# Altium project PCB_Testing_Projekt.PrjPcb
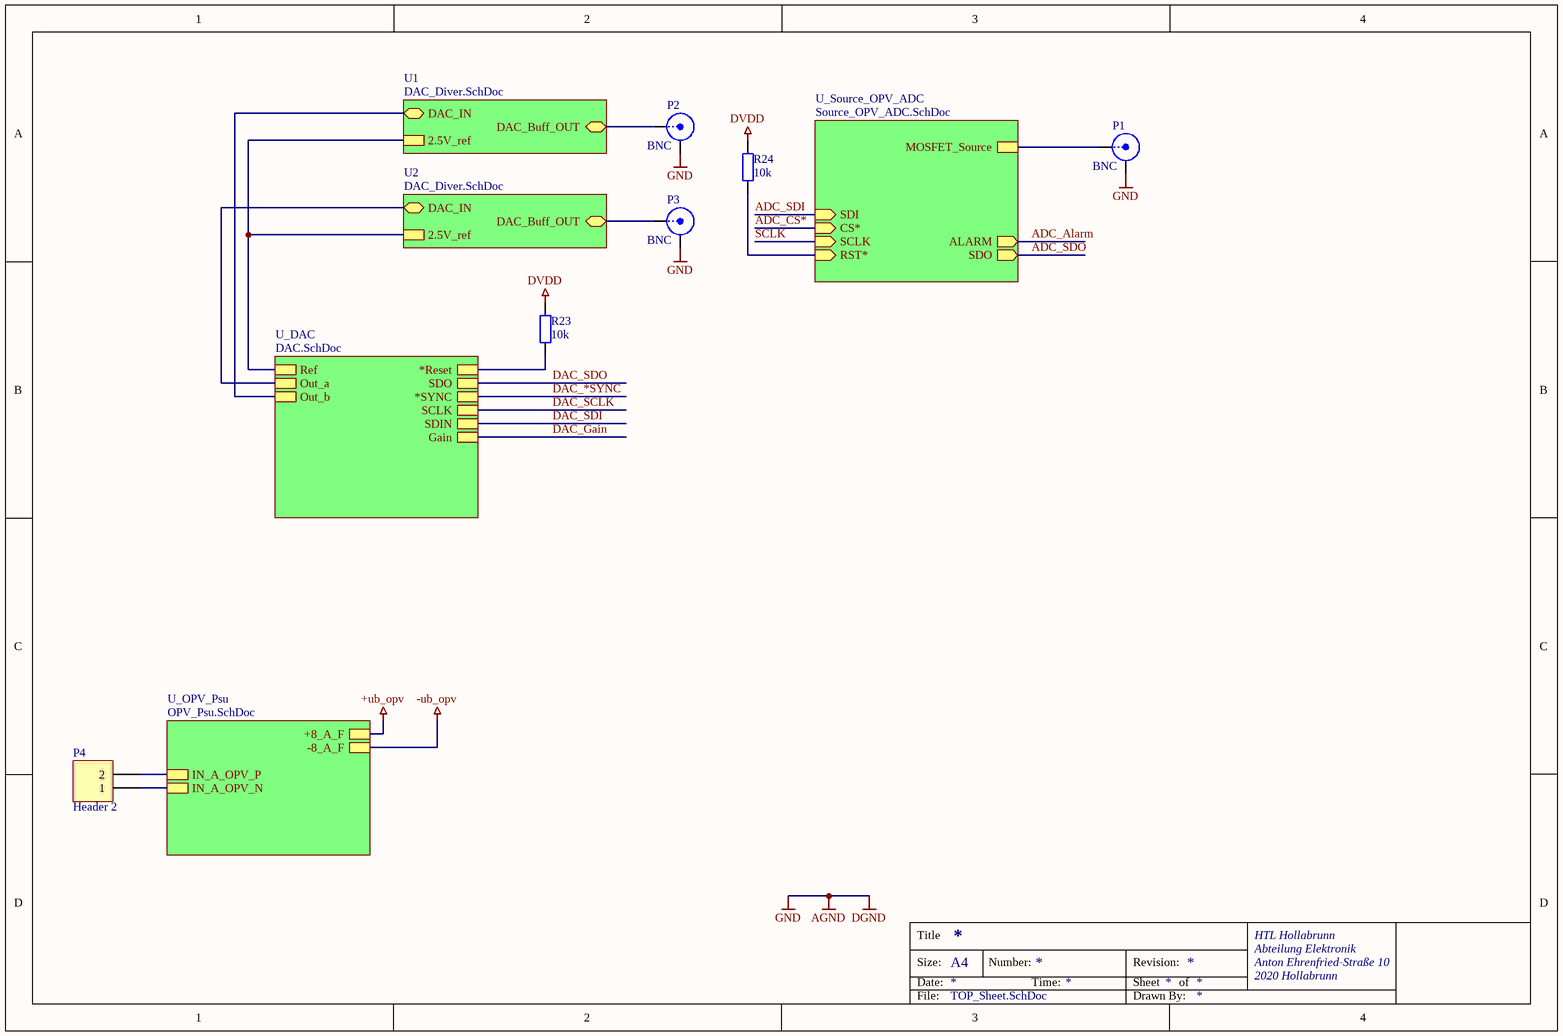
[diagram p0: TOP_Sheet.SchDoc]
5 sheets, 58 parts. Net scope: hierarchical (ports join the sheet entries above them; power ports are global).
Board file: PCB1.PcbDoc
Sheets:
  TOP_Sheet.SchDoc
    U_Source_OPV_ADC = Source_OPV_ADC.SchDoc
    U_OPV_Psu = OPV_Psu.SchDoc
    U2 = DAC_Diver.SchDoc
    U1 = DAC_Diver.SchDoc
    U_DAC = DAC.SchDoc

## Sheet TOP_Sheet.SchDoc
size A4; Organization: HTL Hollabrunn; Address1: Abteilung Elektronik; Address2: Anton Ehrenfried-Straße 10; Address3: 2020 Hollabrunn; SPICEModelCacheBIRIWKQP: <root> / <DocumentId>BIRIWKQP</DocumentId> / </root>

### Parts
P1  BNC  [BNC_RA CON]
P2  BNC  [BNC_RA CON]
P3  BNC  [BNC_RA CON]
P4  Header 2  [HDR1X2]
R23  10k  [C1206-KUE]
R24  10k  [C1206-KUE]

### Sub-sheets
U1 = DAC_Diver.SchDoc: DAC_IN (bidir), DAC_Buff_OUT (bidir), 2.5V_ref
U2 = DAC_Diver.SchDoc: DAC_IN (bidir), DAC_Buff_OUT (bidir), 2.5V_ref
U_DAC = DAC.SchDoc: Ref, Out_a, Out_b, SDIN, SDO, SCLK, *SYNC, Gain, *Reset
U_OPV_Psu = OPV_Psu.SchDoc: IN_A_OPV_P, +8_A_F, IN_A_OPV_N, -8_A_F
U_Source_OPV_ADC = Source_OPV_ADC.SchDoc: MOSFET_Source, SDI (in), CS* (in), SCLK (in), SDO (out), ALARM (out), RST* (in)

### Nets
AGND: P1.2(Y) P2.2(Y) P3.2(Y)  [also labelled DGND, GND]
DVDD: R23.1 R24.1
NetC6_1: P1.1(X) ; sheet U_Source_OPV_ADC/MOSFET_Source
NetC14_2: sheet U2/2.5V_ref, sheet U1/2.5V_ref, sheet U_DAC/Ref
NetP2_1: P2.1(X) ; sheet U1/DAC_Buff_OUT
NetP3_1: P3.1(X) ; sheet U2/DAC_Buff_OUT
NetP4_1: P4.1 ; sheet U_OPV_Psu/IN_A_OPV_N
NetP4_2: P4.2 ; sheet U_OPV_Psu/IN_A_OPV_P
NetR2_1: R24.2 ; sheet U_Source_OPV_ADC/RST*
NetR7_U1_2: sheet U1/DAC_IN, sheet U_DAC/Out_b
NetR7_U2_2: sheet U2/DAC_IN, sheet U_DAC/Out_a
NetR23_2: R23.2 ; sheet U_DAC/*Reset

### Notes on the sheet
- Title
- Size:
- Date:
- A4
- Number:
- Time:
- Revision:
- Sheet
- of
- HTL Hollabrunn
- Abteilung Elektronik
- Anton Ehrenfried-Straße 10
- 2020 Hollabrunn
- File:
- Drawn By:

### Library data of the parts
P1-P3 = BNC: BNC Elbow Connector; LatestRevisionDate: 17-Jul-2002; LatestRevisionNote: Re-released for DXP Platform.; Publisher: Altium Limited
P4 = Header 2: Header, 2-Pin; LatestRevisionDate: 17-Jul-2002; LatestRevisionNote: Re-released for DXP Platform.; Publisher: Altium Limited
R23 R24 = ResistorSMD: Resistor SMD; Manufacturer: AVX; Bezeichnung: SMD Wid. 1/8W 2%; Published: 8-Jun-2000; LatestRevisionDate: 17-Jul-2002; LatestRevisionNote: Re-released for DXP Platform.; PackageReference: AXIAL-0.4; Publisher: Altium Limited; PackageDescription: Axial Device, Thru-Hole; 2 Leads; 0.4 in Pin Spacing; Value: 10k; Orderingcode: *

## Sheet Source_OPV_ADC.SchDoc
size A4; Organization: HTL Hollabrunn; Address1: Abteilung Elektronik; Address2: Anton Ehrenfried-Straße 10; Address3: 2020 Hollabrunn; SheetNumber: 1; SheetTotal: 1; SPICEModelCacheDVQSEWCR: <root> / <DocumentId>DVQSEWCR</DocumentId> / <CacheFrame Number="0"> / <Model Name="ua741" Kind="CKT"> / <Text>*==================================================== / *uA741 / *Sngl GenPurpose OpAmp pkg:DIP8 3,2,7,4,6. pkg:CAN8 3,2,7,4,6. / * Connections: / *             Non-Inverting Input / *             | Inverting Input / *             | | Positive Power Supply / *             | | | Negative Power Supply / *             | | | | Output / *             | | | | | / .SUBCKT UA741 1 2 3 4 5 / C1   11 12 4.664E-12 / C2    6  7 20E-12 / DC    5 53 DX / DE   54  5 DX / DLP  90 91 DX / DLN  92 90 DX / DP    4  3 DX / BGND 99  0 V=V(3)*.5 + V(4)*.5 / BB    7 99 I=I(VB)*10.61E6 - I(VC)*10E6 + I(VE)*10E6 + / +              I(VLP)*10E6 - I(VLN)*10E6 / GA    6  0 11 12 137.7E-6 / GCM   0  6 10 99 2.574E-9 / IEE  10  4 DC 10.16E-6 / HLIM 90  0 VLIM 1K / Q1   11  2 13 QX / Q2   12  1 14 QX / R2    6  9 100E3 / RC1   3 11 7.957E3 / RC2   3 12 7.957E3 / RE1  13 10 2.74E3 / RE2  14 10 2.74E3 / REE  10 99 19.69E6 / RO1   8  5 150 / RO2   7 99 150 / RP    3  4 18.11E3 / VB    9  0 DC 0 / VC    3 53 DC 2.6 / VE   54  4 DC 2.6 / VLIM  7  8 DC 0 / VLP  91  0 DC 25 / VLN   0 92 DC 25 / .MODEL DX D(IS=800E-18) / .MODEL QX NPN(IS=800E-18 BF=62.5) / .ENDS UA741</Text> / </Model> / <Model Name="cap" Kind="MDL"> / <Text>*Default semiconductor capacitor / .MODEL CAP C()</Text> / </Model> / </CacheFrame> / </root>
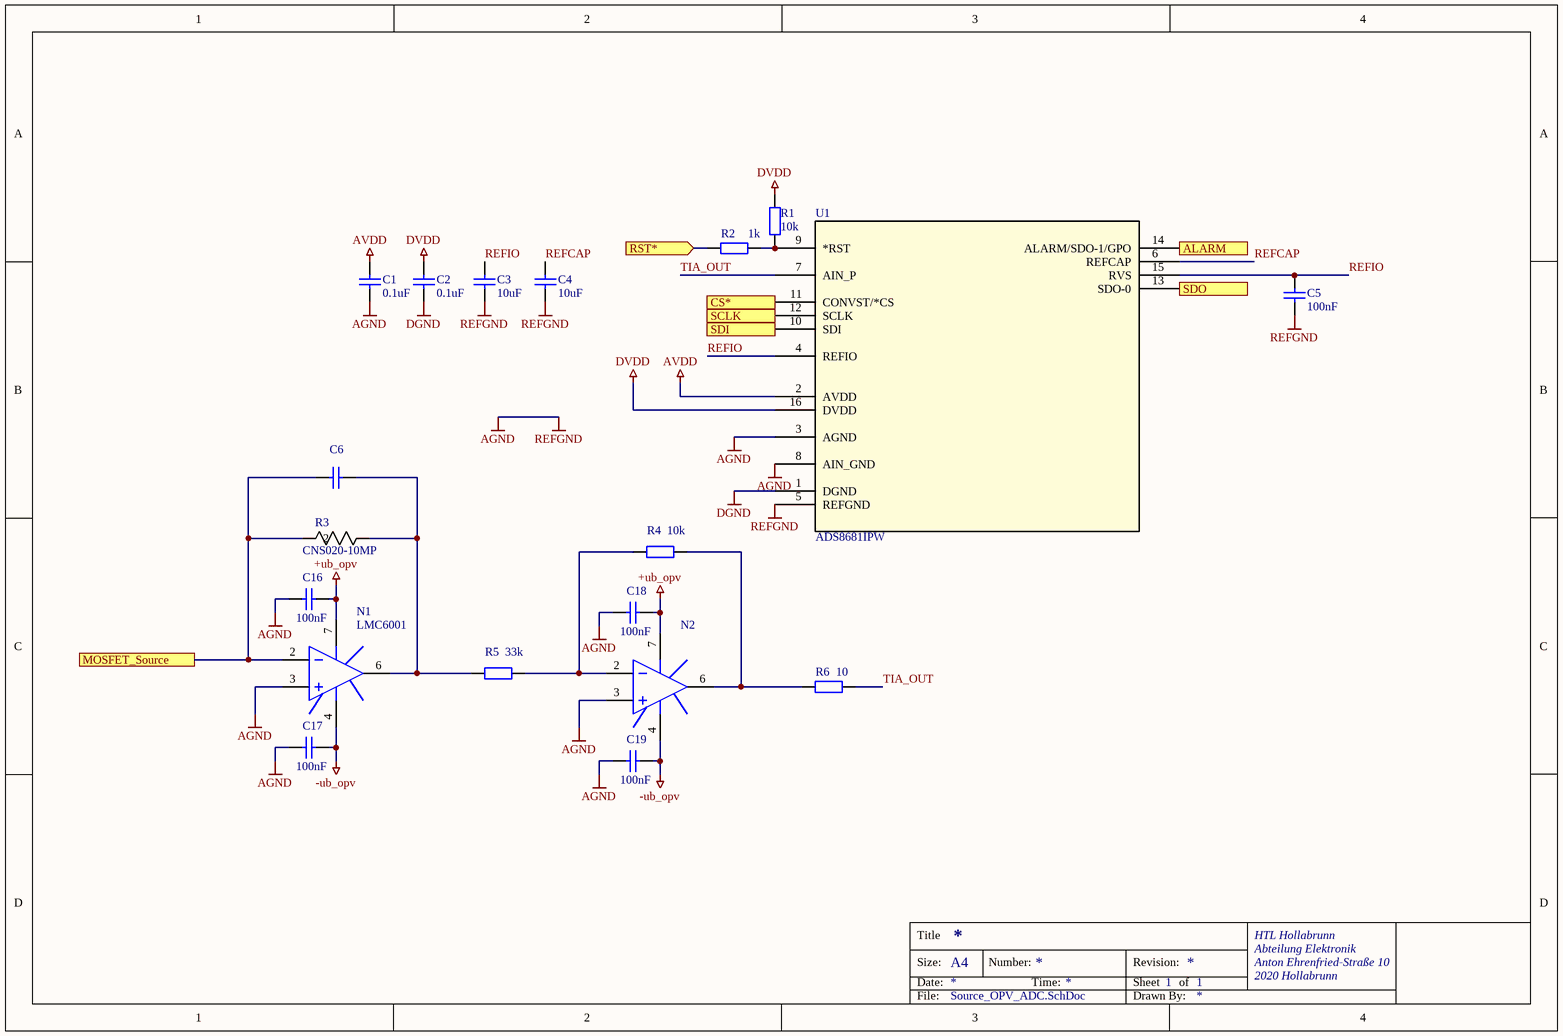
[diagram p1: Source_OPV_ADC.SchDoc]

### Parts
C1  0.1uF  [C1206-KUE]
C2  0.1uF  [C1206-KUE]
C3  10uF  [C1206-KUE]
C4  10uF  [C1206-KUE]
C5  100nF  [C1206-KUE]
C6  100nF  [C1206-KUE]  (value not drawn)
C16  100nF  [C1206-KUE]
C17  100nF  [C1206-KUE]
C18  100nF  [C1206-KUE]
C19  100nF  [C1206-KUE]
N1  LMC6001  [DIP8]
N2  LMC6001  [DIP8]  (value not drawn)
R1  10k  [C1206-KUE]
R2  1k  [C1206-KUE]
R3  CNS020-10MP  [RES_CNS020_VIS]
R4  10k  [C1206-KUE]
R5  33k  [C1206-KUE]
R6  10  [C1206-KUE]
U1  ADS8681IPW  [PW16_TEX]

### Ports
ALARM (out), CS* (in), MOSFET_Source, RST* (in), SCLK (in), SDI (in), SDO (out)

### Nets
+ub_opv: C16.2 C18.2 N1.7(V+) N2.7(V+)  [project net pos_out]
-ub_opv: C17.2 C19.2 N1.4(V-) N2.4(V-)  [project net neg_out]
AGND: C1.1 C2.1 C3.1 C4.1 C5.1 C16.1 C17.1 C18.1 C19.1 N1.3(IN+) N2.3(IN+) U1.1(DGND) U1.3(AGND) U1.5(REFGND) U1.8(AIN_GND)  [also labelled DGND, REFGND]
AVDD: C1.2 U1.2(AVDD)
DVDD: C2.2 R1.1 U1.16(DVDD)
ADC_Alarm: U1.14(ALARM/SDO-1/GPO) ; port ALARM
ADC_CS*: U1.11(CONVST/*CS) ; port CS*
ADC_SDI: U1.10(SDI) ; port SDI
ADC_SDO: U1.13(SDO-0) ; port SDO
REFCAP: C4.2 U1.6(REFCAP)
REFIO: C3.2 C5.2 U1.4(REFIO) U1.15(RVS)
SCLK: U1.12(SCLK) ; port SCLK
TIA_OUT: R6.1 U1.7(AIN_P)
NetC6_1: C6.1 N1.2(IN-) R3.2 ; port MOSFET_Source
NetC6_2: C6.2 N1.6(OUT) R3.1 R5.2
NetN2_2: N2.2(IN-) R4.2 R5.1
NetN2_6: N2.6(OUT) R4.1 R6.2
NetR1_2: R1.2 R2.2 U1.9(*RST)
NetR2_1: R2.1 ; port RST*

Not connected (* = marked no-connect by the designer): N1 1(OS_NULL) 5(OS_NULL) 8(NC); N2 1(OS_NULL) 5(OS_NULL) 8(NC)

### Notes on the sheet
- Title
- Size:
- Date:
- A4
- Number:
- Time:
- Revision:
- Sheet
- of
- HTL Hollabrunn
- Abteilung Elektronik
- Anton Ehrenfried-Straße 10
- 2020 Hollabrunn
- File:
- Drawn By:

### Library data of the parts
C1-C6 C16-C19 = Capacitor: Manufacturer: Kemet; Bezeichnung: Kerko +-10% 63V; Published: 8-Jun-2000; LatestRevisionDate: 17-Jul-2002; LatestRevisionNote: Re-released for DXP Platform.; PackageReference: RAD-0.3; Publisher: Altium Limited; PackageDescription: Radial Cap, Thru-Hole; 2 Leads; 0.3 in Pin Spacing; Orderingcode: *
  C1 C2: Value: 0.1uF
  C3 C4: Value: 10uF
  C5 C6 C16-C19: Value: 100nF
N1 N2 = UA741AN: General-Purpose Single Operational Amplifier; Published: 24-Aug-2001; LatestRevisionDate: 06-Jun-2005; LatestRevisionNote: Stylized 3D Model Added.; DatasheetVersion: Oct-1997; PackageReference: DIP8; Publisher: Altium Limited; PackageDescription: DIP; 8 Leads; Row Spacing 7.62 mm; Pitch 2.54 mm; Code_JEDEC: MO-001-AN; ComponentLink1Description: Manufacturer Link; ComponentLink1URL: http://www.st.com/; ComponentLink2Description: Datasheet; ComponentLink2URL: http://www.st.com/stonline/products/literature/ds/5304/ua741.pdf
R1 R2 R4-R6 = ResistorSMD: as R23 on sheet TOP_Sheet; Published: 8-Jun-2000; LatestRevisionDate: 17-Jul-2002; LatestRevisionNote: Re-released for DXP Platform.; PackageReference: AXIAL-0.4; Publisher: Altium Limited; PackageDescription: Axial Device, Thru-Hole; 2 Leads; 0.4 in Pin Spacing; Orderingcode: *
  R1 R4: Value: 10k
  R2: Value: 1k
  R5: Value: 33k
  R6: Value: 10
R3 = CNS020-10KP: CNS 020 10K 0,02% e2; Manufacturer_Name: Vishay; Copyright: Copyright (C) 2026 Ultra Librarian. All rights reserved.; Manufacturer_Part_Number: CNS020-10KP; Datasheet: https://www.vishay.com/doc?60051
U1 = ADS8681IPW: 16-bit, 1MSPS 1-ch SAR ADC with programmable (Â±12V, Â±10V, Â±6V, Â±5V, Â±2.5V) input ranges on 5V supply 16-TSSOP -40 to 125; Manufacturer_Name: Texas Instruments; Copyright: Copyright (C) 2025 Ultra Librarian. All rights reserved.; Manufacturer_Part_Number: ADS8681IPW; RefDes: RefDes; Type: Type

## Sheet OPV_Psu.SchDoc
size A4; Organization: HTL Hollabrunn; Address1: Abteilung Elektronik; Address2: Anton Ehrenfried-Straße 10; Address3: 2020 Hollabrunn; SPICEModelCacheKALKJBRQ: <root> / <DocumentId>KALKJBRQ</DocumentId> / <CacheFrame Number="0"> / <Model Name="cap" Kind="MDL"> / <Text>*Default semiconductor capacitor / .MODEL CAP C()</Text> / </Model> / </CacheFrame> / </root>
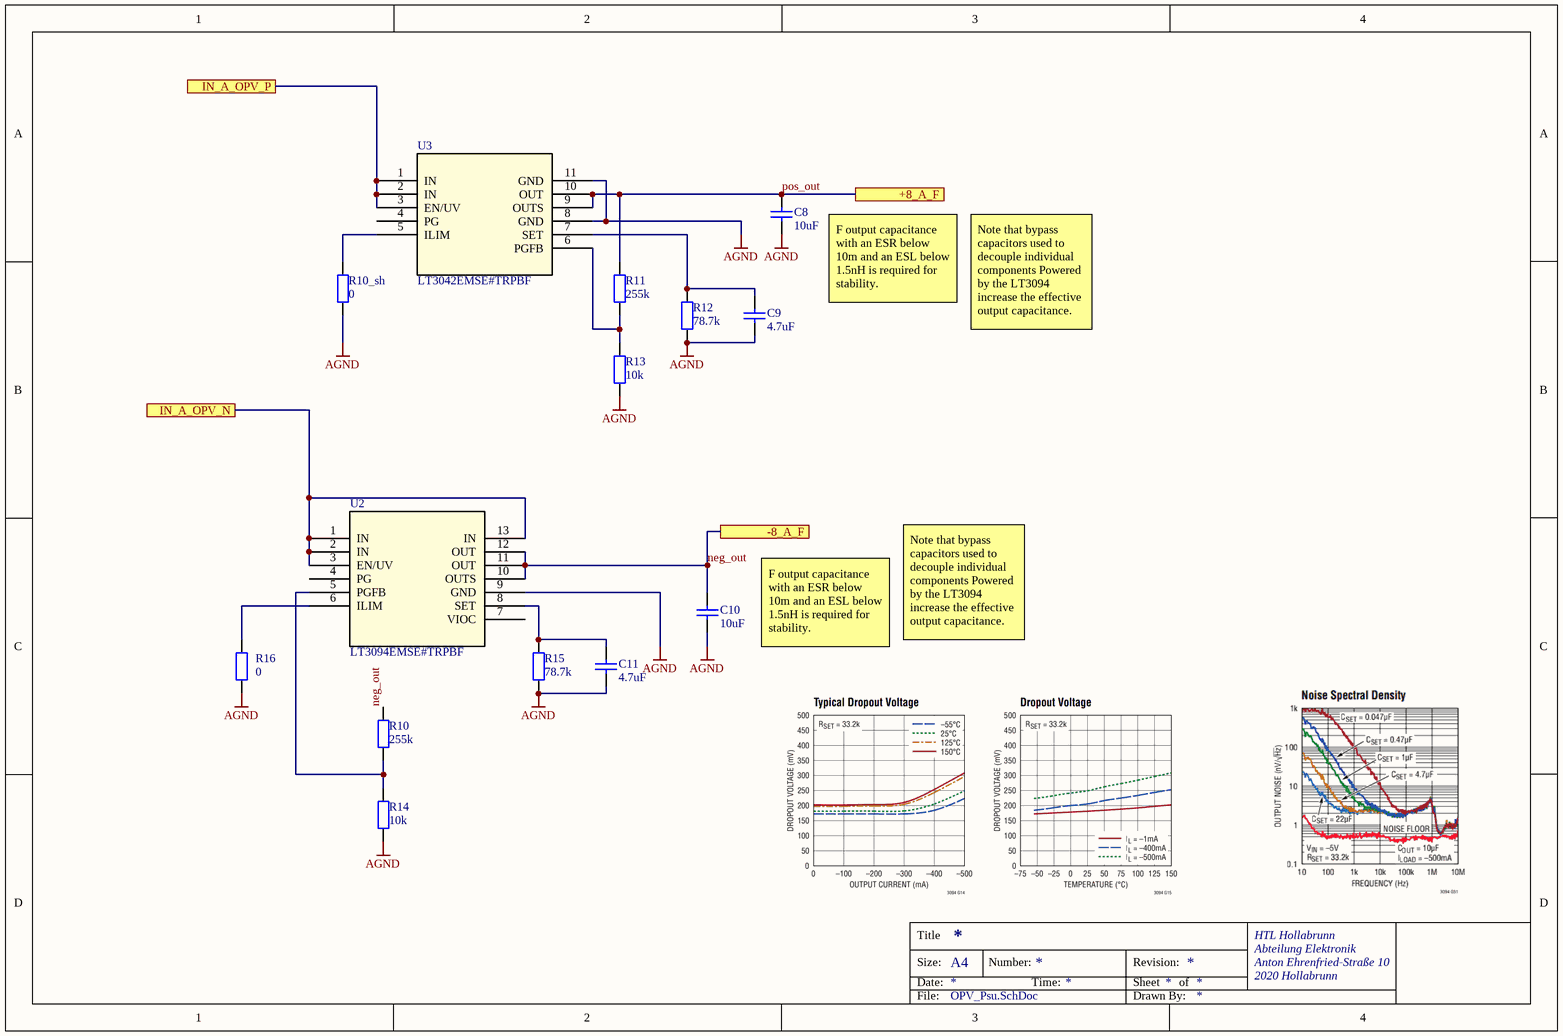
[diagram p2: OPV_Psu.SchDoc]

### Parts
C8  10uF  [C1206-KUE]
C9  4.7uF  [C1206-KUE]
C10  10uF  [C1206-KUE]
C11  4.7uF  [C1206-KUE]
R10  255k  [C1206-KUE]
R10_sh  0  [C1206-KUE]
R11  255k  [C1206-KUE]
R12  78.7k  [C1206-KUE]
R13  10k  [C1206-KUE]
R14  10k  [C1206-KUE]
R15  78.7k  [C1206-KUE]
R16  0  [C1206-KUE]
U2  LT3094EMSE#TRPBF  [MSE_05-08-1666_ADI]
U3  LT3042EMSE#TRPBF  [05-08-1664_ADI]

### Ports
+8_A_F, -8_A_F, IN_A_OPV_N, IN_A_OPV_P

### Nets
AGND: C8.1 C9.1 C10.1 C11.1 R10_sh.2 R12.2 R13.2 R14.2 R15.2 R16.2 U2.9(GND) U3.8(GND) U3.11(GND)
neg_out: C10.2 R10.1 U2.10(OUTS) U2.11(OUT) U2.12(OUT) ; port -8_A_F
pos_out: C8.2 R11.1 U3.9(OUTS) U3.10(OUT) ; port +8_A_F
NetC9_2: C9.2 R12.1 U3.7(SET)
NetC11_2: C11.2 R15.1 U2.8(SET)
NetP4_1: U2.1(IN) U2.2(IN) U2.3(EN/UV) U2.13(IN) ; port IN_A_OPV_N
NetP4_2: U3.1(IN) U3.2(IN) U3.3(EN/UV) ; port IN_A_OPV_P
NetR10_2: R10.2 R14.1 U2.5(PGFB)
NetR10_sh_1: R10_sh.1 U3.5(ILIM)
NetR11_2: R11.2 R13.1 U3.6(PGFB)
NetR16_1: R16.1 U2.6(ILIM)

Not connected (* = marked no-connect by the designer): U2 4(PG) 7(VIOC); U3 4(PG)

### Notes on the sheet
- F output capacitance with an ESR below 10m and an ESL below 1.5nH is required for stability.
- Note that bypass capacitors used to decouple individual components Powered by the LT3094 increase the effective output capacitance.
- Title
- Size:
- Date:
- A4
- Number:
- Time:
- Revision:
- Sheet
- of
- HTL Hollabrunn
- Abteilung Elektronik
- Anton Ehrenfried-Straße 10
- 2020 Hollabrunn
- File:
- Drawn By:

### Library data of the parts
C8-C11 = Capacitor: as C1 on sheet Source_OPV_ADC; Published: 8-Jun-2000; LatestRevisionDate: 17-Jul-2002; LatestRevisionNote: Re-released for DXP Platform.; PackageReference: RAD-0.3; Publisher: Altium Limited; PackageDescription: Radial Cap, Thru-Hole; 2 Leads; 0.3 in Pin Spacing; Orderingcode: *
  C8 C10: Value: 10uF
  C9 C11: Value: 4.7uF
R10 R10_sh R11-R16 = ResistorSMD: as R23 on sheet TOP_Sheet; Published: 8-Jun-2000; LatestRevisionDate: 17-Jul-2002; LatestRevisionNote: Re-released for DXP Platform.; PackageReference: AXIAL-0.4; Publisher: Altium Limited; PackageDescription: Axial Device, Thru-Hole; 2 Leads; 0.4 in Pin Spacing; Orderingcode: *
  R10 R11: Value: 255k
  R10_sh R16: Value: 0
  R12 R15: Value: 78.7k
  R13 R14: Value: 10k
U2 = LT3094EMSETRPBF: âˆ’20V, 500mA, Ultralow Noise, Ultrahigh PSRR Negative Linear Regulator; Manufacturer_Name: Analog Devices Inc; Copyright: Copyright (C) 2025 Ultra Librarian. All rights reserved.; Manufacturer_Part_Number: LT3094EMSE#TRPBF; RefDes: RefDes; Type: Type
U3 = LT3042EMSETRPBF: 20V, 200mA, Ultralow Noise, Ultrahigh PSRR RF Linear Regulator; Manufacturer_Name: Analog Devices Inc; Type: Power Management; Copyright: Copyright (C) 2025 Ultra Librarian. All rights reserved.; Manufacturer_Part_Number: LT3042EMSE#TRPBF; RefDes: RefDes

## Sheet DAC_Diver.SchDoc
size A4; Organization: HTL Hollabrunn; Address1: Abteilung Elektronik; Address2: Anton Ehrenfried-Straße 10; Address3: 2020 Hollabrunn; SPICEModelCacheETVKZAQX: <root> / <DocumentId>ETVKZAQX</DocumentId> / <CacheFrame Number="0"> / <Model Name="cap" Kind="MDL"> / <Text>*Default semiconductor capacitor / .MODEL CAP C()</Text> / </Model> / <Model Name="ua741" Kind="CKT"> / <Text>*==================================================== / *uA741 / *Sngl GenPurpose OpAmp pkg:DIP8 3,2,7,4,6. pkg:CAN8 3,2,7,4,6. / * Connections: / *             Non-Inverting Input / *             | Inverting Input / *             | | Positive Power Supply / *             | | | Negative Power Supply / *             | | | | Output / *             | | | | | / .SUBCKT UA741 1 2 3 4 5 / C1   11 12 4.664E-12 / C2    6  7 20E-12 / DC    5 53 DX / DE   54  5 DX / DLP  90 91 DX / DLN  92 90 DX / DP    4  3 DX / BGND 99  0 V=V(3)*.5 + V(4)*.5 / BB    7 99 I=I(VB)*10.61E6 - I(VC)*10E6 + I(VE)*10E6 + / +              I(VLP)*10E6 - I(VLN)*10E6 / GA    6  0 11 12 137.7E-6 / GCM   0  6 10 99 2.574E-9 / IEE  10  4 DC 10.16E-6 / HLIM 90  0 VLIM 1K / Q1   11  2 13 QX / Q2   12  1 14 QX / R2    6  9 100E3 / RC1   3 11 7.957E3 / RC2   3 12 7.957E3 / RE1  13 10 2.74E3 / RE2  14 10 2.74E3 / REE  10 99 19.69E6 / RO1   8  5 150 / RO2   7 99 150 / RP    3  4 18.11E3 / VB    9  0 DC 0 / VC    3 53 DC 2.6 / VE   54  4 DC 2.6 / VLIM  7  8 DC 0 / VLP  91  0 DC 25 / VLN   0 92 DC 25 / .MODEL DX D(IS=800E-18) / .MODEL QX NPN(IS=800E-18 BF=62.5) / .ENDS UA741</Text> / </Model> / </CacheFrame> / </root>
Used 2 times, as channels U2, U1. Parts and nets are listed once, with the designators drawn on the sheet.
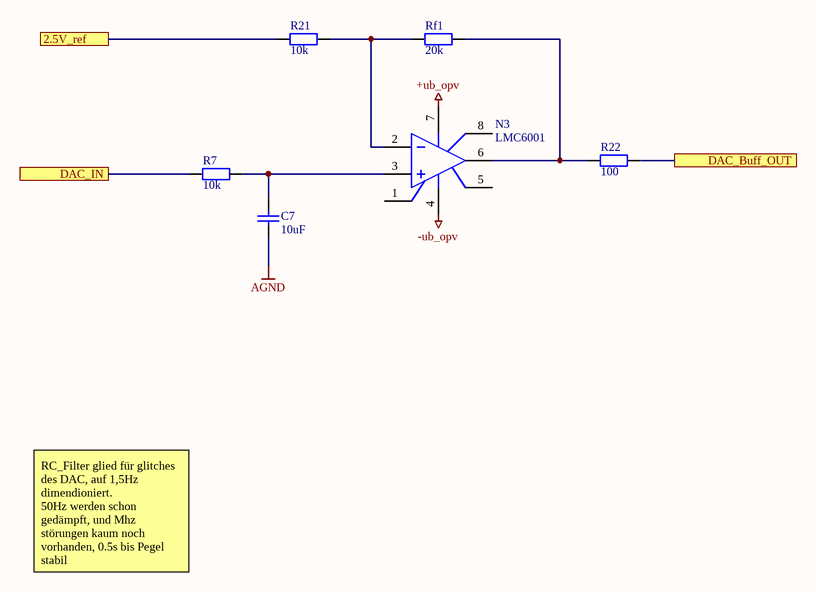
[diagram p3: DAC_Diver.SchDoc]

### Parts
C7  10uF  [C1206-KUE]
N3  LMC6001  [DIP8]
R7  10k  [C1206-KUE]
R21  10k  [C1206-KUE]
R22  100  [C1206-KUE]
Rf1  20k  [C1206-KUE]

### Ports
2.5V_ref, DAC_Buff_OUT, DAC_IN

### Nets
+ub_opv: N3.7(V+)
-ub_opv: N3.4(V-)
AGND: C7.1
2.5V_ref: R21.2 ; port 2.5V_ref
DAC_Buff_OUT: R22.1 ; port DAC_Buff_OUT
DAC_IN: R7.2 ; port DAC_IN
NetC7_2: C7.2 N3.3(IN+) R7.1
NetN3_2: N3.2(IN-) R21.1 Rf1.2
NetN3_6: N3.6(OUT) R22.2 Rf1.1

Not connected (* = marked no-connect by the designer): N3 1(OS_NULL) 5(OS_NULL) 8(NC)

### Channels
U2: designators end in _U2; ports 2.5V_ref=NetC14_2 DAC_Buff_OUT=NetP3_1 DAC_IN=NetR7_U2_2
U1: designators end in _U1; ports 2.5V_ref=NetC14_2 DAC_Buff_OUT=NetP2_1 DAC_IN=NetR7_U1_2

### Notes on the sheet
- RC_Filter glied für glitches des DAC, auf 1,5Hz dimendioniert.
  50Hz werden schon gedämpft, und Mhz störungen kaum noch vorhanden, 0.5s bis Pegel stabil
- Title
- Size:
- Date:
- A4
- Number:
- Time:
- Revision:
- Sheet
- of
- HTL Hollabrunn
- Abteilung Elektronik
- Anton Ehrenfried-Straße 10
- 2020 Hollabrunn
- File:
- Drawn By:

### Library data of the parts
C7 = Capacitor: as C1 on sheet Source_OPV_ADC; Published: 8-Jun-2000; LatestRevisionDate: 17-Jul-2002; LatestRevisionNote: Re-released for DXP Platform.; PackageReference: RAD-0.3; Publisher: Altium Limited; PackageDescription: Radial Cap, Thru-Hole; 2 Leads; 0.3 in Pin Spacing; Value: 10uF; Orderingcode: *
N3 = UA741AN: as N1 on sheet Source_OPV_ADC; Published: 24-Aug-2001; LatestRevisionDate: 06-Jun-2005; LatestRevisionNote: Stylized 3D Model Added.; DatasheetVersion: Oct-1997; PackageReference: DIP8; Publisher: Altium Limited; PackageDescription: DIP; 8 Leads; Row Spacing 7.62 mm; Pitch 2.54 mm; Code_JEDEC: MO-001-AN; ComponentLink1Description: Manufacturer Link; ComponentLink1URL: http://www.st.com/; ComponentLink2Description: Datasheet; ComponentLink2URL: http://www.st.com/stonline/products/literature/ds/5304/ua741.pdf
R7 R21 R22 Rf1 = ResistorSMD: as R23 on sheet TOP_Sheet; Published: 8-Jun-2000; LatestRevisionDate: 17-Jul-2002; LatestRevisionNote: Re-released for DXP Platform.; PackageReference: AXIAL-0.4; Publisher: Altium Limited; PackageDescription: Axial Device, Thru-Hole; 2 Leads; 0.4 in Pin Spacing; Orderingcode: *
  R7 R21: Value: 10k
  R22: Value: 100
  Rf1: Value: 20k

## Sheet DAC.SchDoc
size A4; Organization: HTL Hollabrunn; Address1: Abteilung Elektronik; Address2: Anton Ehrenfried-Straße 10; Address3: 2020 Hollabrunn; SPICEModelCacheALEDFFPD: <root> / <DocumentId>ALEDFFPD</DocumentId> / <CacheFrame Number="0"> / <Model Name="cap" Kind="MDL"> / <Text>*Default semiconductor capacitor / .MODEL CAP C()</Text> / </Model> / </CacheFrame> / </root>
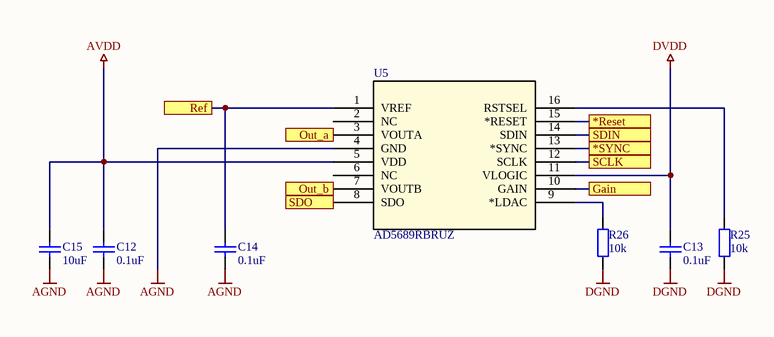
[diagram p4: DAC.SchDoc]

### Parts
C12  0.1uF  [C1206-KUE]
C13  0.1uF  [C1206-KUE]
C14  0.1uF  [C1206-KUE]
C15  10uF  [C1206-KUE]
R25  10k  [C1206-KUE]
R26  10k  [C1206-KUE]
U5  AD5689RBRUZ  [RU_16_ADI]

### Ports
*Reset, *SYNC, Gain, Out_a, Out_b, Ref, SCLK, SDIN, SDO

### Nets
AGND: C12.1 C13.1 C14.1 C15.1 R25.2 R26.2 U5.4(GND)  [also labelled DGND]
AVDD: C12.2 C15.2 U5.5(VDD)
DVDD: C13.2 U5.11(VLOGIC)
DAC_*SYNC: U5.13(*SYNC) ; port *SYNC
DAC_Gain: U5.10(GAIN) ; port Gain
DAC_SCLK: U5.12(SCLK) ; port SCLK
DAC_SDI: U5.14(SDIN) ; port SDIN
DAC_SDO: U5.8(SDO) ; port SDO
NetC14_2: C14.2 U5.1(VREF) ; port Ref
NetR7_U1_2: U5.7(VOUTB) ; port Out_b
NetR7_U2_2: U5.3(VOUTA) ; port Out_a
NetR23_2: U5.15(*RESET) ; port *Reset
NetR25_1: R25.1 U5.16(RSTSEL)
NetR26_1: R26.1 U5.9(*LDAC)

Not connected (* = marked no-connect by the designer): U5 2(NC) 6(NC)

### Notes on the sheet
- Title
- Size:
- Date:
- A4
- Number:
- Time:
- Revision:
- Sheet
- of
- HTL Hollabrunn
- Abteilung Elektronik
- Anton Ehrenfried-Straße 10
- 2020 Hollabrunn
- File:
- Drawn By:

### Library data of the parts
C12-C15 = Capacitor: as C1 on sheet Source_OPV_ADC; Published: 8-Jun-2000; LatestRevisionDate: 17-Jul-2002; LatestRevisionNote: Re-released for DXP Platform.; PackageReference: RAD-0.3; Publisher: Altium Limited; PackageDescription: Radial Cap, Thru-Hole; 2 Leads; 0.3 in Pin Spacing; Orderingcode: *
  C12-C14: Value: 0.1uF
  C15: Value: 10uF
R25 R26 = ResistorSMD: as R23 on sheet TOP_Sheet; Published: 8-Jun-2000; LatestRevisionDate: 17-Jul-2002; LatestRevisionNote: Re-released for DXP Platform.; PackageReference: AXIAL-0.4; Publisher: Altium Limited; PackageDescription: Axial Device, Thru-Hole; 2 Leads; 0.4 in Pin Spacing; Value: 10k; Orderingcode: *
U5 = AD5689RBRUZ: Dual, 16-Bit nanoDAC+ with 2 ppm/Â°C Reference, SPI Interface; Manufacturer_Name: Analog Devices Inc; Copyright: Copyright (C) 2026 Ultra Librarian. All rights reserved.; Manufacturer_Part_Number: AD5689RBRUZ; RefDes: RefDes; Type: Type

## Nets that join several sheets
AGND: TOP_Sheet (P1.2 P2.2 P3.2), Source_OPV_ADC (15 pins), OPV_Psu (13 pins), U2 (C7_U2.1), U1 (C7_U1.1), DAC (7 pins)
AVDD: Source_OPV_ADC (C1.2 U1.2), DAC (C12.2 C15.2 U5.5)
DVDD: TOP_Sheet (R23.1 R24.1), Source_OPV_ADC (C2.2 R1.1 U1.16), DAC (C13.2 U5.11)
neg_out: Source_OPV_ADC (C17.2 C19.2 N1.4 N2.4), OPV_Psu (5 pins), U2 (N3_U2.4), U1 (N3_U1.4)
pos_out: Source_OPV_ADC (C16.2 C18.2 N1.7 N2.7), OPV_Psu (C8.2 R11.1 U3.9 U3.10), U2 (N3_U2.7), U1 (N3_U1.7)
NetC6_1: TOP_Sheet (P1.1), Source_OPV_ADC (C6.1 N1.2 R3.2)
NetC14_2: U2 (R21_U2.2), U1 (R21_U1.2), DAC (C14.2 U5.1)
NetP2_1: TOP_Sheet (P2.1), U1 (R22_U1.1)
NetP3_1: TOP_Sheet (P3.1), U2 (R22_U2.1)
NetP4_1: TOP_Sheet (P4.1), OPV_Psu (U2.1 U2.2 U2.3 U2.13)
NetP4_2: TOP_Sheet (P4.2), OPV_Psu (U3.1 U3.2 U3.3)
NetR2_1: TOP_Sheet (R24.2), Source_OPV_ADC (R2.1)
NetR7_U1_2: U1 (R7_U1.2), DAC (U5.7)
NetR7_U2_2: U2 (R7_U2.2), DAC (U5.3)
NetR23_2: TOP_Sheet (R23.2), DAC (U5.15)